# EAGLE design Color sensor (EAGLE 5.10)
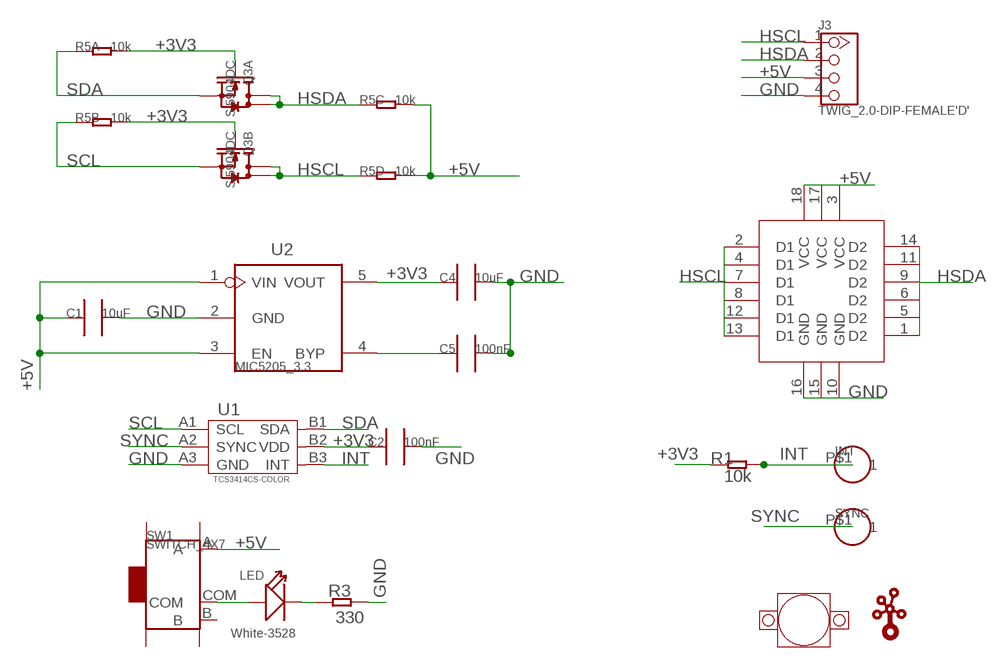
[diagram p0: schematic, sheet 1]

## Parts
C1  10uF  C0805_S  [0805_S]
C2  100nF  C0603_S  [0603_S]
C4  10uF  C0805_S  [0805_S]
C5  100nF  C0603_S  [0603_S]
INT  CK_1X132  [CK_1X1]
J3  TWIG_2.0-DIP-FEMALE'D'  [2.0_1X4_90]
LED  White-3528  007-LED1.6*2.7  [LED1210]
Q3  Si5904DC  010-DUAL-N-MOSFET_1206-8  [1206-8]
R1  10k  R0603  [0603]
R3  330  R0603  [0603]
R5  10k  005-4R_1206  [R1206-8]
SW1  SWITCH_4X7  [4*8_SW]
SYNC  CK_1X132  [CK_1X1]
TWIG1  TWIG-U2  [U2]
U1  TCS3414CS-COLOR  [TCS3414CS]
U2  MIC5205_3.3  MIC5025_X.X  [SOT23-5]
U3  LENS_HOOD  [LENS_HOOD]
U$1  TWIGLOGOTWIGLOGO_SMALL  [TWIGLOGO_SMALL]

## Nets
+3V3: C2.1 C4.1 Q3.2(A:G) Q3.4(B:G) R1.1 R5.7 R5.8 U1.B2(VDD) U2.5(VOUT)
+5V: C1.1 J3.3 R5.5 R5.6 SW1.A TWIG1.3(VCC) TWIG1.17(VCC) TWIG1.18(VCC) U2.1(VIN) U2.3(EN)
GND: C1.2 C2.2 C4.2 C5.2 J3.4 R3.1 TWIG1.10(GND) TWIG1.15(GND) TWIG1.16(GND) U1.A3(GND) U2.2(GND)
HSCL: J3.1 Q3.5(B:D) Q3.6(B:D) R5.4 TWIG1.2(D1) TWIG1.4(D1) TWIG1.7(D1) TWIG1.8(D1) TWIG1.12(D1) TWIG1.13(D1)
HSDA: J3.2 Q3.7(A:D) Q3.8(A:D) R5.3 TWIG1.1(D2) TWIG1.5(D2) TWIG1.6(D2) TWIG1.9(D2) TWIG1.11(D2) TWIG1.14(D2)
INT: INT.P$1 R1.2 U1.B3(INT)
N$2: LED.1(+) SW1.COM
N$3: C5.1 U2.4(BYP)
N$5: LED.2(-) R3.2
SCL: Q3.3(B:S) R5.2 U1.A1(SCL)
SDA: Q3.1(A:S) R5.1 U1.B1(SDA)
SYNC: SYNC.P$1 U1.A2(SYNC)
Unconnected: SW1.B SW1.SS1 SW1.SS2 SW1.SS3 SW1.SS4

## Library data of the parts
C1 C4 = CPT_SMD:C0805
C2 C5 = CPT_SMD:C0603
INT SYNC = CONNECTER1:CK_1X1
J3 = Connector:TWIG_2.0-DIP-FEMALE
LED = Discrete:007-LED*
Q3 = Discrete:010-DUAL-N-MOSFET*: Si5902BDC Si5904DC Si5908DC Si5920DC
R1 R3 = CPT_SMD1:R0603
R5 = Discrete:005-4R*: Resistor Array
SW1 = CPT_SMD:SWITCH
TWIG1 = twig_template2:TWIG-U2
U1 = sensor:TCS3414CS-COLOR
U2 = ICs_v54:MIC5025_X.X
U3 = machine:LENS_HOOD
U$1 = seeedleo:TWIGLOGO

## Board
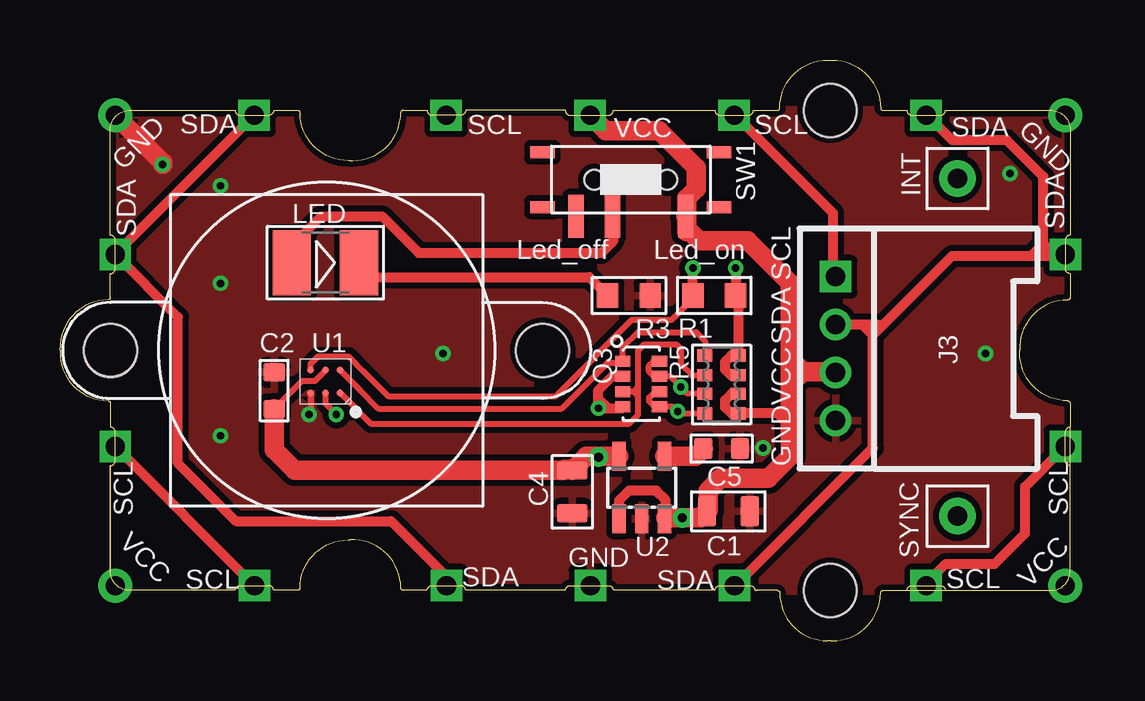
[diagram p1: board, top side]
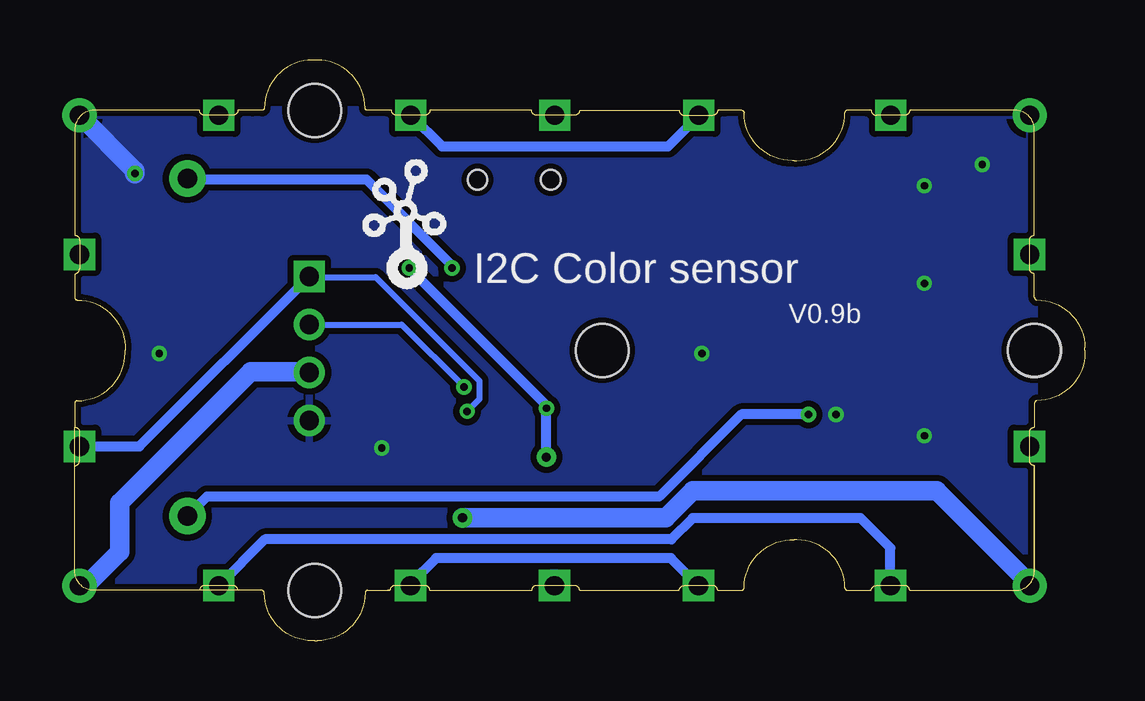
[diagram p2: board, bottom side, seen from below]

Size 42.09 x 24.2 mm. Coordinates in mm from the lower left corner, seen from the top.
Copper layers (1*16): Top 0.035mm / dielectric 1.5mm / Bottom 0.035mm
Design rules "SeeedStudio_rule_no_angle_090911 *": minimum track width 6mil, minimum drill 12mil, track to track 6mil, track to pad 6mil, pad to pad 6mil, via to via 6mil, smd to smd 0mil, copper to edge 10mil, drill to drill 10mil, minimum pad ring 10mil, minimum via ring 6mil, stop-mask expansion 2mil, vias tented up to drill 20mil, thermal gap 10mil

### Footprints (pad centres in the part's own frame; a part is rotated, then mirrored left to right if it is on the bottom)
0805_S = smd 0.762 x 1.27: 1 -0.889,0; 2 0.889,0
0603_S = smd 0.762 x 0.889: 1 -0.762,0; 2 0.762,0
CK_1X1 = drill 0.813 pad 1.524 round: P$1 0,0
2.0_1X4_90 = drill 0.8 pad 1.27 square: 1 -3,0 | drill 0.8 pad 1.27 round: 2 -1,0; 3 1,0; 4 3,0
LED1210 = smd 1.6 x 2.7: 1 -1.4,0; 2 1.4,0
1206-8 = smd 0.457 x 0.635: 1 -0.953,-0.762; 2 -0.318,-0.762; 3 0.318,-0.762; 4 0.953,-0.762; 5 0.953,0.762; 6 0.318,0.762; 7 -0.318,0.762; 8 -0.953,0.762
0603 = smd 0.889 x 1.016: 1 -0.889,0; 2 0.889,0
R1206-8 = smd 0.508 x 0.635: 1 -1.206,-0.699; 2 -0.381,-0.699; 3 0.381,-0.699; 4 1.206,-0.699; 5 1.206,0.699; 6 0.381,0.699; 7 -0.381,0.699; 8 -1.206,0.699
4*8_SW = smd 1.778 x 0.635: A 1.524,2.286; B 1.524,-2.286; COM 1.524,-0.762 | smd 0.508 x 1.016: SS1 -1.143,-3.683; SS2 1.143,-3.683; SS3 1.143,3.683; SS4 -1.143,3.683 | hole 0.813: 0,-1.524; 0,1.524
U2 = drill 0.8 pad 1.27 square: 1 -13.965,9.8; 2 -5.965,9.8; 3 0.035,9.8; 4 6.035,9.8; 5 14.035,9.8; 6 19.835,4; 7 19.835,-4; 8 14.035,-9.8; 9 6.045,-9.8; 10 0.045,-9.8; 11 -5.955,-9.8; 12 -13.955,-9.8; 13 -19.755,-4; 14 -19.755,4 | drill 0.8 pad 1.422 round: 15 -19.755,9.8; 16 19.835,9.8; 17 19.835,-9.8; 18 -19.755,-9.8 | hole 2.2: 10.033,-10; 10.033,10; -19.955,0.005
TCS3414CS = smd 0.3 x 0.3: A1 -0.61,0.475; A2 0,0.475; A3 0.61,0.475; B1 -0.61,-0.475; B2 0,-0.475; B3 0.61,-0.475
SOT23-5 = smd 0.55 x 1.2: 1 -0.95,-1.3; 2 0,-1.3; 3 0.95,-1.3; 4 0.95,1.3; 5 -0.95,1.3
LENS_HOOD = hole 2.2: 9,0; -9,0

### Placement (x,y rotation side)
C1  27.85,5.39 0 top
C2  8.92,10.42 90 top
C4  21.34,6.21 270 top
C5  27.57,8.01 0 top
INT  37.4,19.26 270 top
J3  32.32,12.18 270 top
LED  11.06,15.76 0 top
Q3  24.21,10.7 270 top
R1  27.26,14.39 180 top
R3  23.71,14.39 180 top
R5  27.57,10.68 270 top
SW1  23.78,19.21 270 top
SYNC  37.4,5.19 0 top
TWIG1  22.05,12.1 0 top
U1  11.06,10.8 180 top
U2  24.24,6.38 0 top
U3  11.11,12.1 0 top
U$1  30.49,14.54 0 bottom

### Tracks (layer width: path | path; a pad name or v marks a point on that pad's centre or on a via)
+3V3  (via drill 0.3 pad 0.64, 0.38 pad 0.81)
  Top 0.254: U1.B2 11.06,11.26 10.62,10.83 10.09,10.83 C2.1
  Top 0.406: R5.7 27.95,11.06 27.7,11.31 27.7,11.62 27.96,11.88 R5.8 28.27,14.27 R1.1 v28.15,15.53 | U2.5 22.47,7.69 v22.44,7.65 | 22.82,9.69 23.39,9.69 Q3.4 | Q3.2 23.01,11.02 22.44,10.45 22.44,10.07 | 22.44,10.07 v22.44,9.69 22.82,9.69 | 22.44,10.07 22.82,9.69
  Top 0.813: U2.5 21.93,7.69 C4.1 21.29,7.15 21.04,7.15 20.99,7.1 9.79,7.1 8.92,7.97 C2.1
  Bottom 0.406: v22.44,7.65 v22.44,9.69 22.44,9.81 v28.15,15.53
+5V  (via drill 0.38 pad 0.81)
  Top 0.406: R5.6 27.98,10.3 27.72,10.03 27.72,9.73 27.98,9.47 R5.5 | R5.5 28.28,9.46 | U2.1 23.29,5.84 23.71,6.26 24.85,6.26 25.23,5.88 25.23,5.12 U2.3 | 29.97,9.47 30.4,9.47 30.44,9.43 | 29.97,9.47 R5.5 | 29.97,9.47 30.31,9.81 30.31,9.05 29.93,9.43
  Top 0.813: 25.23,5.12 v25.93,5.12 26.69,5.12 C1.1 27.01,5.45 27.01,6.26 27.52,6.77 29.52,6.77 30.44,7.69 30.44,9.43 30.44,10.7 | 30.44,10.7 30.95,11.21 | J3.3 32.28,11.21 31.07,11.21 30.95,11.21 | 26.12,17.64 26.12,18.45 26.5,18.83 26.5,19.72 24.98,21.24 22.75,21.24 TWIG1.3 | 26.12,17.18 26.12,17.64 | 26.12,17.18 26.12,17.05 | 26.12,17.64 SW1.A | 30.44,10.7 30.44,11.72 | 30.44,11.72 30.44,14.89 28.66,16.67 26.63,16.67 26.12,17.18 | 30.95,11.21 30.44,11.72
  Bottom 0.813: TWIG1.17 41.63,2.3 40.22,3.72 40.22,5.75 34.75,11.21 32.35,11.21 J3.3 | TWIG1.18 2.3,2.38 6.18,6.26 16.34,6.26 17.47,5.12 v25.93,5.12
GND  (via drill 0.3 pad 0.64)
  Top 0.254: U1.A3 10.45,9.51 v10.37,9.43
  Top 0.813: v4.27,19.85 4.27,19.92 TWIG1.15
  Bottom 0.813: v39.58,19.47 39.58,19.59 TWIG1.16
  other vias: 6.69,8.54 6.69,14.89 38.56,11.97 29.29,8.04 6.69,18.96 15.96,11.97
  pour Top (isolate 0.254): 2.12,22.13 41.74,22.13 41.99,21.88 41.99,2.07 2.37,2.07 2.12,2.32
  pour Bottom (isolate 0.254): 2.12,22.13 41.74,22.13 41.99,21.88 41.99,2.07 2.37,2.07 2.12,2.32
HSCL  (via drill 0.3 pad 0.64)
  Top 0.254: 26.83,9.43 R5.4 25.83,9.47 v25.74,9.56 25.55,9.75 Q3.5 24.79,9.75 24.55,9.99 24.55,10.13 24.81,10.39 Q3.6
  Top 0.406: TWIG1.8 36.09,2.39 36.91,3.21 38.95,3.21 40.22,4.48 40.22,6.43 TWIG1.7 | TWIG1.13 TWIG1.12 | TWIG1.4 28.13,21.9 32.22,17.81 32.22,15.28 J3.1
  Bottom 0.254: v25.74,9.56 25.23,10.07 25.23,10.83 29.55,15.15 32.29,15.15 J3.1
  Bottom 0.406: TWIG1.7 39.39,8.1 J3.1 | TWIG1.12 8.1,3.87 9.35,5.12 16.34,5.12 17.23,4.23 34.16,4.23 TWIG1.8 | TWIG1.2 16.09,21.88 17.37,20.6 26.79,20.6 TWIG1.4
HSDA  (via drill 0.3 pad 0.64)
  Top 0.254: R5.3 26.84,10.32 26.12,10.32 v25.87,10.58 25.42,11.02 Q3.7 24.73,11.02 24.53,11.22 24.53,11.46 24.73,11.66 Q3.8
  Top 0.406: 33.99,13.18 J3.2 | 33.99,13.18 34.31,13.18 37.17,16.04 40.47,16.04 | 40.47,16.04 40.98,16.04 | 41.49,16.04 41.83,16.04 TWIG1.6 | TWIG1.5 36.13,21.9 37.17,20.86 39.45,20.86 40.98,19.34 40.98,16.55 | TWIG1.9 28.13,2.3 33.87,8.04 33.87,12.74 | 33.87,12.74 33.87,13.05 33.99,13.18 | TWIG1.1 TWIG1.14 4.91,13.49 4.91,7.4 7.32,4.99 13.8,4.99 16.1,2.69 TWIG1.11 | 33.87,12.74 33.48,13.12 34.25,13.12 33.87,12.74 | 40.98,16.04 40.98,16.55 | 40.98,16.55 41.49,16.04 | 40.98,16.04 41.49,16.04 | 40.47,16.04 40.98,16.55
  Bottom 0.254: J3.2 28.47,13.18 v25.87,10.58
  Bottom 0.406: TWIG1.9 28.1,2.37 27.03,3.44 17.25,3.44 TWIG1.11
INT  (via drill 0.3 pad 0.64)
  Top 0.254: R1.2 26.37,14.26 25.48,13.37 23.83,13.37 20.66,10.2 13.67,10.2 12.66,11.21 12.02,11.85 10.75,11.85 10.45,11.54 U1.B3
  Top 0.406: R1.2 v26.37,15.53
  Bottom 0.406: v26.37,15.53 26.37,15.66 29.93,19.21 37.35,19.21 INT.P$1
N$2
  Top 0.406: SW1.COM 23.07,17.64 23.07,16.67 22.56,16.16 14.94,16.16 13.42,17.69 10.88,17.69 9.61,16.42 9.61,15.8 LED.1
N$3
  Top 0.813: U2.4 26.48,7.69 C5.1
N$5
  Top 0.406: R3.2 22.05,15.15 13.07,15.15 LED.2
SCL
  Top 0.254: 24.09,10.2 24.09,10.58 | 24.09,10.58 24.09,12.1 24.34,12.35 25.69,12.35 25.87,12.17 25.87,11.53 26.34,11.06 R5.2 | 23.9,10.39 Q3.3 | 24.09,10.2 23.9,10.39 | 24.09,10.2 24.09,9.41 23.73,9.05 12.94,9.05 U1.A1 | 24.09,10.58 23.9,10.39
SDA
  Top 0.254: R5.1 26.88,11.9 26.88,12.48 26.5,12.86 24.09,12.86 23.45,12.23 Q3.1 23.39,11.59 22.82,11.59 20.9,9.68 13.27,9.68 12.51,10.44 U1.B1
SYNC  (via drill 0.3 pad 0.64)
  Top 0.254: U1.A2 11.06,9.89 v11.51,9.43
  Bottom 0.406: SYNC.P$1 36.58,6 17.74,6 14.31,9.43 v11.51,9.43

### Text on the board
tPlace: GND | SDA | SCL | SCL | VCC | SDA | GND | SDA | SDA | Led_off | Led_on | SCL | SDA | VCC | GND | SCL | SCL | VCC | VCC | SCL | SDA | GND | SDA | SCL
bPlace: I2C Color sensor | V0.9b